# Altium project 8SoundsUSB.PrjPCB (part 2 of 2)

## Sheet XS1_XCORE0.SchDoc: XS1 CORE0
size A3; Date: 2011-11-28; Author: S.Choquette; Revision: 2.0; SheetNumber: 3; SheetTotal: 9
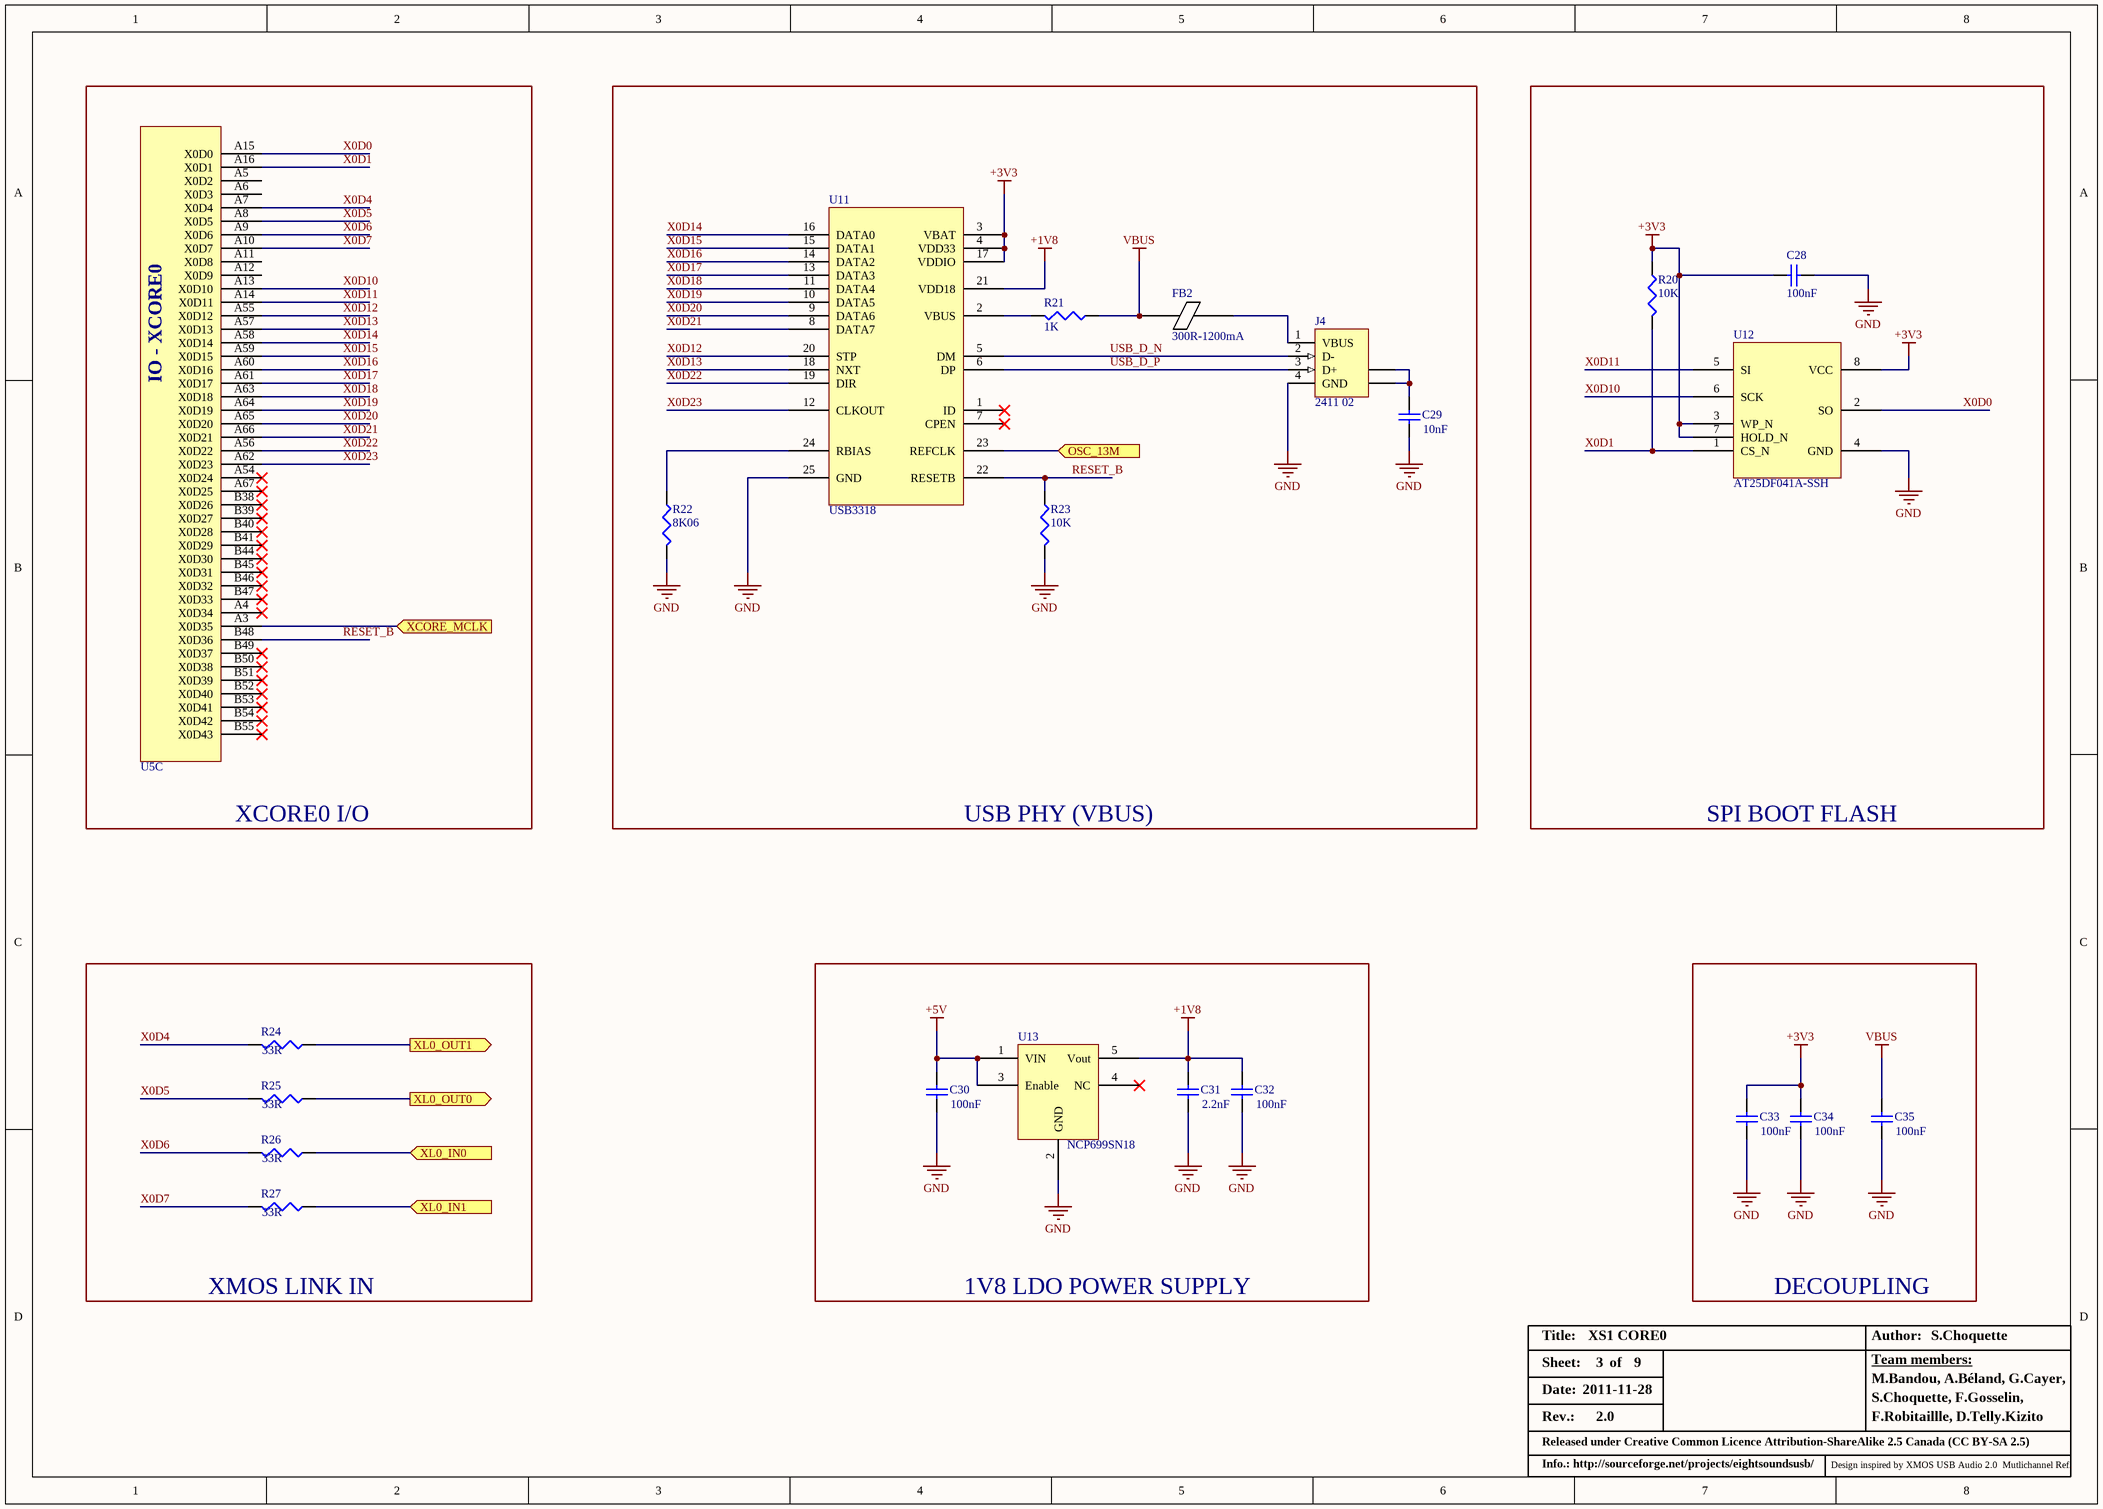
[diagram p7: XS1_XCORE0.SchDoc]

### Parts
C28  value 100nF  [3-0603]
C29  value 10nF  [3-0603]
C30  value 100nF  [3-0603]
C31  value 2.2nF  [3-0603]
C32  value 100nF  [3-0603]
C33  value 100nF  [3-0603]
C34  value 100nF  [3-0603]
C35  value 100nF  [3-0603]
FB2  300R-1200mA  [3-0603]
J4  2411 02  [787924]
R20  value 10K  [3-0603]
R21  value 1K  [3-0603]
R22  value 8K06  [3-0603]
R23  value 10K  [3-0603]
R24  value 33R  [3-0603]
R25  value 33R  [3-0603]
R26  value 33R  [3-0603]
R27  value 33R  [3-0603]
U5  XS1_L2_124QFN  [QFN-124]  (value not drawn)  (part C of 4)
U11  USB3318  [QFN50P400X400-24V9L]
U12  AT25DF041A-SSH  [8S1_L]
U13  NCP699SN18  [SOT23-5AL_MOD(1-07)]

### Blocks framed on the sheet
XCORE0 I/O: U5
USB PHY (VBUS): C29 FB2 J4 R21-R23 U11
SPI BOOT FLASH: C28 R20 U12
XMOS LINK IN: R24-R27
1V8 LDO POWER SUPPLY: C30-C32 U13
DECOUPLING: C33-C35

### Ports
OSC_13M (in), XCORE_MCLK (in), XL0_IN0 (in), XL0_IN1 (in), XL0_OUT0, XL0_OUT1

### Nets
+1V8: C31.2 C32.2 U11.21(VDD18) U13.5(Vout)
+3V3: C28.2 C33.2 C34.2 R20.1 U11.3(VBAT) U11.4(VDD33) U11.17(VDDIO) U12.3(WP_N) U12.7(HOLD_N) U12.8(VCC)
+5V: C30.2 U13.1(VIN) U13.3(Enable)
GND: C28.1 C29.1 C30.1 C31.1 C32.1 C33.1 C34.1 C35.1 J4.4(GND) R22.2 R23.2 U11.25(GND) U12.4(GND) U13.2(GND)
VBUS: C35.2 FB2.2 R21.1
OSC_13M: U11.23(REFCLK) ; port OSC_13M
RESET_B: R23.1 U5.B48(X0D36) U11.22(RESETB)
USB_D_N: J4.2(D-) U11.5(DM)
USB_D_P: J4.3(D+) U11.6(DP)
X0D0: U5.A15(X0D0) U12.2(SO)
X0D1: R20.2 U5.A16(X0D1) U12.1(CS_N)
X0D4: R24.2 U5.A7(X0D4)
X0D5: R25.2 U5.A8(X0D5)
X0D6: R26.2 U5.A9(X0D6)
X0D7: R27.2 U5.A10(X0D7)
X0D10: U5.A13(X0D10) U12.6(SCK)
X0D11: U5.A14(X0D11) U12.5(SI)
X0D12: U5.A55(X0D12) U11.20(STP)
X0D13: U5.A57(X0D13) U11.18(NXT)
X0D14: U5.A58(X0D14) U11.16(DATA0)
X0D15: U5.A59(X0D15) U11.15(DATA1)
X0D16: U5.A60(X0D16) U11.14(DATA2)
X0D17: U5.A61(X0D17) U11.13(DATA3)
X0D18: U5.A63(X0D18) U11.11(DATA4)
X0D19: U5.A64(X0D19) U11.10(DATA5)
X0D20: U5.A65(X0D20) U11.9(DATA6)
X0D21: U5.A66(X0D21) U11.8(DATA7)
X0D22: U5.A56(X0D22) U11.19(DIR)
X0D23: U5.A62(X0D23) U11.12(CLKOUT)
XCORE_MCLK: U5.A3(X0D35) ; port XCORE_MCLK
XL0_IN0: R26.1 ; port XL0_IN0
XL0_IN1: R27.1 ; port XL0_IN1
XL0_OUT0: R25.1 ; port XL0_OUT0
XL0_OUT1: R24.1 ; port XL0_OUT1
NetC29_2: C29.2 J4.5(SHLD) J4.6(SHLD)
NetFB2_1: FB2.1 J4.1(VBUS)
NetR21_2: R21.2 U11.2(VBUS)
NetR22_1: R22.1 U11.24(RBIAS)

Not connected (* = marked no-connect by the designer): U5 A4(X0D34)* A5(X0D2) A6(X0D3) A11(X0D8) A12(X0D9) A54(X0D24)* A67(X0D25)* B38(X0D26)* B39(X0D27)* B40(X0D28)* B41(X0D29)* B44(X0D30)* B45(X0D31)* B46(X0D32)* B47(X0D33)* B49(X0D37)* B50(X0D38)* B51(X0D39)* B52(X0D40)* B53(X0D41)* B54(X0D42)* B55(X0D43)*; U11 1(ID)* 7(CPEN)*; U13 4(NC)*

### Notes on the sheet
- Title:
- Date:
- Sheet:
- of
- Author:
- Team members:
- M.Bandou, A.Béland, G.Cayer,
- Rev.:
- Released under Creative Common Licence Attribution-ShareAlike 2.5 Canada (CC BY-SA 2.5)
- S.Choquette, F.Gosselin,
- F.Robitaillle, D.Telly.Kizito
- Info.: http://sourceforge.net/projects/eightsoundsusb/
- Design inspired by XMOS USB Audio 2.0  Mutlichannel Ref.
- (in symbol XS1_L2_124QFN, part C) IO - XCORE0

### Library data of the parts
C28 C30 C32-C35 = Cap: MLCC 100nF 0603 X7R 16V; Manufacturer: Murata; Part Number: GRM188R71C104KA01; Cost: 0,005
C29 = Cap: MLCC 10nF 0603 X7R 50V; Manufacturer: Murata; Part Number: GRM188R71H103KA01; Cost: 0,005
C31 = Cap: MLCC 2.2uF 0603 X5R 10V; Manufacturer: Murata; Part Number: GRM188R61A225KE34; Cost: 0,005
FB2 = 300R-1200mA: Ferrite 300R -1200mA; Part Number: BLM18SG331TN1D; Manufacturer: Murata
J4 = 787924-1: USB 2.0 connectors  Connecteurs USB 2.0; Manufacturer: Lumberg; TerminationLength: 3.02mm [0.119in.]; Part Number: 2411 02; Cost: *
R20 R23 = Res3: RES 10k 0603 1%; Manufacturer: ROHM; Part Number: MCR03EZPFX1002; Cost: *
R21 = Res3: as R4 on sheet MAIN_POWER; Cost: *
R22 = Res3: RES 8k06 0603 1%; Manufacturer: ROHM; Part Number: MCR03EZPFX8061; Cost: *
R24-R27 = Res3: as R41 on sheet CLOCKING; Cost: *
U5 = XS1_L2_124QFN: Manufacturer: XMOS; Part Number: XS1-L02A-QF124-C4; Cost: *
U11 = USB3318: USB-IF 'High-Speed' compliant to USB 2.0; Manufacturer: SMSC; Part Number: USB3318; Cost: *
U12 = AT25DF041A-SSH: 4-megabit  2.3-volt or  2.7-volt  Minimum  SPI Serial Flash  Memory; Manufacturer: ATMEL; Part Number: AT25DF041A-SSH; Cost: *
U13 = NCP699SN18: 150 mA CMOS Low Iq LDO; Manufacturer: ON Semiconductor; Part Number: NCP699SN18

## Sheet XS1_XCORE1.SchDoc: XS1 XCORE1
size A3; Date: 2011-11-28; Author: S.Choquette; Revision: 2.0; SheetNumber: 4; SheetTotal: 9
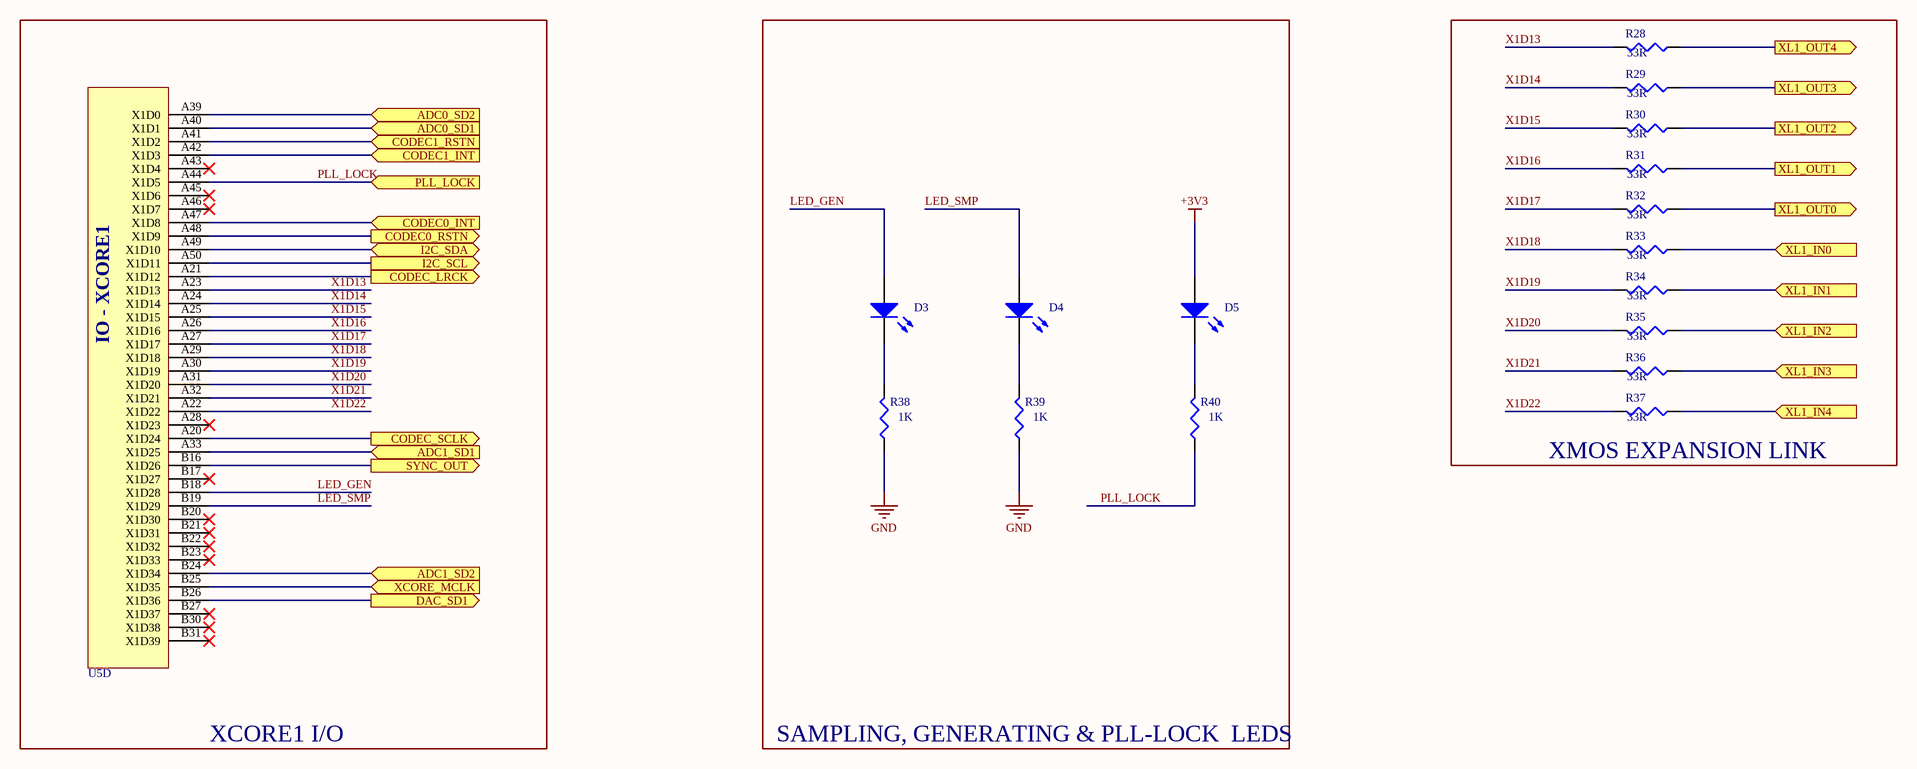
[diagram p8: XS1_XCORE1.SchDoc]

### Parts
D3  GEN  [LED_0603]  (value not drawn)
D4  SMP  [LED_0603]  (value not drawn)
D5  PLL  [LED_0603]  (value not drawn)
R28  value 33R  [3-0603]
R29  value 33R  [3-0603]
R30  value 33R  [3-0603]
R31  value 33R  [3-0603]
R32  value 33R  [3-0603]
R33  value 33R  [3-0603]
R34  value 33R  [3-0603]
R35  value 33R  [3-0603]
R36  value 33R  [3-0603]
R37  value 33R  [3-0603]
R38  value 1K  [3-0603]
R39  value 1K  [3-0603]
R40  value 1K  [3-0603]
U5  XS1_L2_124QFN  [QFN-124]  (value not drawn)  (part D of 4)

### Blocks framed on the sheet
XCORE1 I/O: U5
SAMPLING, GENERATING & PLL-LOCK  LEDS: D3-D5 R38-R40
XMOS EXPANSION LINK: R28-R37

### Ports
ADC0_SD1 (in), ADC0_SD2 (in), ADC1_SD1 (in), ADC1_SD2 (in), CODEC0_INT (in), CODEC0_RSTN (out), CODEC1_INT (in), CODEC1_RSTN (in), CODEC_LRCK (out), CODEC_SCLK (out), DAC_SD1 (out), I2C_SCL (out), I2C_SDA (bidir), PLL_LOCK (in), SYNC_OUT (out), XCORE_MCLK (in), XL1_IN0 (in), XL1_IN1 (in), XL1_IN2 (in), XL1_IN3 (in), XL1_IN4 (in), XL1_OUT0 (out), XL1_OUT1 (out), XL1_OUT2 (out), XL1_OUT3 (out), XL1_OUT4 (out)

### Nets
+3V3: D5.1(A)
GND: R38.1 R39.1
ADC0_SD1: U5.A40(X1D1) ; port ADC0_SD1
ADC0_SD2: U5.A39(X1D0) ; port ADC0_SD2
ADC1_SD1: U5.A33(X1D25) ; port ADC1_SD1
ADC1_SD2: U5.B24(X1D34) ; port ADC1_SD2
CODEC0_INT: U5.A47(X1D8) ; port CODEC0_INT
CODEC0_RSTN: U5.A48(X1D9) ; port CODEC0_RSTN
CODEC1_INT: U5.A42(X1D3) ; port CODEC1_INT
CODEC1_RSTN: U5.A41(X1D2) ; port CODEC1_RSTN
DAC_SD1: U5.B26(X1D36) ; port DAC_SD1
I2C_SCL: U5.A50(X1D11) ; port I2C_SCL
I2C_SDA: U5.A49(X1D10) ; port I2C_SDA
LED_GEN: D3.1(A) U5.B18(X1D28)
LED_SMP: D4.1(A) U5.B19(X1D29)
PLL_LOCK: R40.1 U5.A44(X1D5) ; port PLL_LOCK
SYNC_OUT: U5.B16(X1D26) ; port SYNC_OUT
X1D13: R28.2 U5.A23(X1D13)
X1D14: R29.2 U5.A24(X1D14)
X1D15: R30.2 U5.A25(X1D15)
X1D16: R31.2 U5.A26(X1D16)
X1D17: R32.2 U5.A27(X1D17)
X1D18: R33.2 U5.A29(X1D18)
X1D19: R34.2 U5.A30(X1D19)
X1D20: R35.2 U5.A31(X1D20)
X1D21: R36.2 U5.A32(X1D21)
X1D22: R37.2 U5.A22(X1D22)
XCORE_MCLK: U5.B25(X1D35) ; port XCORE_MCLK
NetD3_2: D3.2(K) R38.2
NetD4_2: D4.2(K) R39.2
NetD5_2: D5.2(K) R40.2
NetJ3_2: R28.1 ; port XL1_OUT4
NetJ3_4: R29.1 ; port XL1_OUT3
NetJ3_6: R31.1 ; port XL1_OUT1
NetJ3_8: R30.1 ; port XL1_OUT2
NetJ3_10: R32.1 ; port XL1_OUT0
NetJ3_12: R35.1 ; port XL1_IN2
NetJ3_14: R33.1 ; port XL1_IN0
NetJ3_16: R36.1 ; port XL1_IN3
NetJ3_18: R34.1 ; port XL1_IN1
NetJ3_20: R37.1 ; port XL1_IN4
NetTP3_1: U5.A21(X1D12) ; port CODEC_LRCK
NetTP7_1: U5.A20(X1D24) ; port CODEC_SCLK

Not connected (* = marked no-connect by the designer): U5 A28(X1D23)* A43(X1D4)* A45(X1D6)* A46(X1D7)* B17(X1D27)* B20(X1D30)* B21(X1D31)* B22(X1D32)* B23(X1D33)* B27(X1D37)* B30(X1D38)* B31(X1D39)*

### Notes on the sheet
- Title:
- Date:
- Sheet:
- of
- Author:
- Team members:
- M.Bandou, A.Béland, G.Cayer,
- Rev.:
- Released under Creative Common Licence Attribution-ShareAlike 2.5 Canada (CC BY-SA 2.5)
- S.Choquette, F.Gosselin,
- F.Robitaillle, D.Telly.Kizito
- Info.: http://sourceforge.net/projects/eightsoundsusb/
- Design inspired by XMOS USB Audio 2.0  Mutlichannel Ref.
- (in symbol XS1_L2_124QFN, part D) IO - XCORE1

### Library data of the parts
D3-D5 = LED2: LED, GREEN, 0603; Manufacturer: Kingbright; Part Number: APT1608CGCK; Publisher: Altium Limited
R28-R37 = Res3: RES 33R 0603 1%; Manufacturer: ROHM; Part Number: MCR03EZPFX33R0; Cost: *
R38-R40 = Res3: RES 1k 0603 1%; Manufacturer: ROHM; Part Number: MCR03EZPFX1001; Cost: *
U5 = XS1_L2_124QFN: Manufacturer: XMOS; Part Number: XS1-L02A-QF124-C4; Cost: *

## Nets that join several sheets
+1V0: MAIN_POWER (TP63.1), XS1_SYSTEM (20 pins)
+1V8: MAIN_POWER (TP62.1), XS1_XCORE0 (C31.2 C32.2 U11.21 U13.5)
+3V3: MAIN_POWER (TP61.1), CLOCKING (11 pins), CODEC0 (13 pins), CODEC1 (14 pins), XS1_SYSTEM (25 pins), XS1_XCORE0 (10 pins), XS1_XCORE1 (D5.1)
+4V3: MAIN_POWER (5 pins), CODEC0 (7 pins), CODEC1 (7 pins), PREAMP0 (16 pins), PREAMP1 (16 pins)
+5V: MAIN_POWER (6 pins), XS1_SYSTEM (8 pins), XS1_XCORE0 (C30.2 U13.1 U13.3)
GND: MAIN_POWER (41 pins), CLOCKING (16 pins), CODEC0 (32 pins), CODEC1 (26 pins), PREAMP0 (32 pins), PREAMP1 (32 pins), XS1_SYSTEM (42 pins), XS1_XCORE0 (14 pins), XS1_XCORE1 (R38.1 R39.1)
VBUS: MAIN_POWER (C9.2 D1.1 TP64.1 U3.6), XS1_XCORE0 (C35.2 FB2.2 R21.1)
ADC0_AIN1_N: MAIN_POWER (TP1.1), CODEC0 (U19.45), PREAMP0 (C93.2 R68.1 R78.1)
ADC0_AIN1_P: MAIN_POWER (TP5.1), CODEC0 (U19.46), PREAMP0 (C93.1 R70.1 R80.1)
ADC0_AIN2_N: MAIN_POWER (TP11.1), CODEC0 (U19.47), PREAMP0 (C105.2 R84.1 R94.1)
ADC0_AIN2_P: MAIN_POWER (TP9.1), CODEC0 (U19.48), PREAMP0 (C105.1 R86.1 R96.1)
ADC0_AIN3_N: MAIN_POWER (TP16.1), CODEC0 (U19.49), PREAMP0 (C94.2 R69.1 R79.1)
ADC0_AIN3_P: MAIN_POWER (TP14.1), CODEC0 (U19.50), PREAMP0 (C94.1 R71.1 R81.1)
ADC0_AIN4_N: MAIN_POWER (TP21.1), CODEC0 (U19.51), PREAMP0 (C106.2 R85.1 R95.1)
ADC0_AIN4_P: MAIN_POWER (TP19.1), CODEC0 (U19.52), PREAMP0 (C106.1 R87.1 R97.1)
ADC0_SD1: MAIN_POWER (TP4.1), CODEC0 (U19.13), XS1_XCORE1 (U5.A40)
ADC0_SD2: MAIN_POWER (TP8.1), CODEC0 (U19.12), XS1_XCORE1 (U5.A39)
ADC1_AIN1_N: MAIN_POWER (TP31.1), CODEC1 (U20.45), PREAMP1 (C117.2 R100.1 R110.1)
ADC1_AIN1_P: MAIN_POWER (TP33.1), CODEC1 (U20.46), PREAMP1 (C117.1 R102.1 R112.1)
ADC1_AIN2_N: MAIN_POWER (TP36.1), CODEC1 (U20.47), PREAMP1 (C129.2 R116.1 R126.1)
ADC1_AIN2_P: MAIN_POWER (TP35.1), CODEC1 (U20.48), PREAMP1 (C129.1 R118.1 R128.1)
ADC1_AIN3_N: MAIN_POWER (TP38.1), CODEC1 (U20.49), PREAMP1 (C118.2 R101.1 R111.1)
ADC1_AIN3_P: MAIN_POWER (TP37.1), CODEC1 (U20.50), PREAMP1 (C118.1 R103.1 R113.1)
ADC1_AIN4_N: MAIN_POWER (TP40.1), CODEC1 (U20.51), PREAMP1 (C130.2 R117.1 R127.1)
ADC1_AIN4_P: MAIN_POWER (TP39.1), CODEC1 (U20.52), PREAMP1 (C130.1 R119.1 R129.1)
ADC1_SD1: MAIN_POWER (TP10.1), CODEC1 (U20.13), XS1_XCORE1 (U5.A33)
ADC1_SD2: MAIN_POWER (TP13.1), CODEC1 (U20.12), XS1_XCORE1 (U5.B24)
CODEC0_INT: MAIN_POWER (TP12.1), CODEC0 (U19.61), XS1_XCORE1 (U5.A47)
CODEC0_RSTN: MAIN_POWER (TP15.1), CODEC0 (R61.2 U19.3), XS1_XCORE1 (U5.A48)
CODEC0_VQ: MAIN_POWER (TP24.1), CODEC0 (C61.1 C62.2 U19.43), PREAMP0 (12 pins)
CODEC1_INT: MAIN_POWER (TP17.1), CODEC1 (U20.61), XS1_XCORE1 (U5.A42)
CODEC1_RSTN: MAIN_POWER (TP20.1), CODEC1 (R67.2 U20.3), XS1_XCORE1 (U5.A41)
CODEC1_VQ: MAIN_POWER (TP42.1), CODEC1 (C79.1 C80.2 U20.43), PREAMP1 (12 pins)
DAC_SD1: MAIN_POWER (TP18.1), CODEC0 (U19.17), XS1_XCORE1 (U5.B26)
I2C_SCL: MAIN_POWER (TP29.1), CLOCKING (U15.9), CODEC0 (R57.1 U19.63), CODEC1 (R64.1 U20.63), XS1_XCORE1 (U5.A50)
I2C_SDA: MAIN_POWER (TP30.1), CLOCKING (U15.10), CODEC0 (R58.1 U19.64), CODEC1 (R65.1 U20.64), XS1_XCORE1 (U5.A49)
NetJ3_2: XS1_SYSTEM (J3.2), XS1_XCORE1 (R28.1)
NetJ3_4: XS1_SYSTEM (J3.4), XS1_XCORE1 (R29.1)
NetJ3_6: XS1_SYSTEM (J3.6), XS1_XCORE1 (R31.1)
NetJ3_8: XS1_SYSTEM (J3.8), XS1_XCORE1 (R30.1)
NetJ3_10: XS1_SYSTEM (J3.10), XS1_XCORE1 (R32.1)
NetJ3_12: XS1_SYSTEM (J3.12), XS1_XCORE1 (R35.1)
NetJ3_14: XS1_SYSTEM (J3.14), XS1_XCORE1 (R33.1)
NetJ3_16: XS1_SYSTEM (J3.16), XS1_XCORE1 (R36.1)
NetJ3_18: XS1_SYSTEM (J3.18), XS1_XCORE1 (R34.1)
NetJ3_20: XS1_SYSTEM (J3.20), XS1_XCORE1 (R37.1)
NetR42_1: MAIN_POWER (TP22.1), CLOCKING (R42.1), CODEC0 (U19.10)
NetR43_1: MAIN_POWER (TP41.1), CLOCKING (R43.1), CODEC1 (U20.10)
NetR46_1: MAIN_POWER (TP6.1), CLOCKING (R46.1), CODEC0 (U19.9)
NetR47_1: MAIN_POWER (TP34.1), CLOCKING (R47.1), CODEC1 (U20.9)
NetR48_1: MAIN_POWER (TP27.1), CLOCKING (R48.1), CODEC0 (U19.18)
NetR49_1: MAIN_POWER (TP2.1), CLOCKING (R49.1), CODEC0 (U19.5)
NetR50_1: MAIN_POWER (TP32.1), CLOCKING (R50.1), CODEC1 (U20.5)
NetR51_1: MAIN_POWER (TP25.1), CLOCKING (R51.1), CODEC0 (U19.19)
NetTP3_1: MAIN_POWER (TP3.1), CLOCKING (U18.1 U18.3 U18.6), XS1_XCORE1 (U5.A21)
NetTP7_1: MAIN_POWER (TP7.1), CLOCKING (U17.1 U17.3 U17.6), XS1_XCORE1 (U5.A20)
OSC_13M: MAIN_POWER (TP43.1), CLOCKING (R44.1 R45.1 U14.4), XS1_SYSTEM (U5.B6 U5.B7), XS1_XCORE0 (U11.23)
PLL_LOCK: MAIN_POWER (TP26.1), CLOCKING (U15.4), XS1_XCORE1 (R40.1 U5.A44)
SYNC_OUT: MAIN_POWER (TP28.1), CLOCKING (U15.5), XS1_XCORE1 (U5.B16)
XCORE_MCLK: MAIN_POWER (TP23.1), CLOCKING (R41.1), XS1_XCORE0 (U5.A3), XS1_XCORE1 (U5.B25)
XL0_IN0: XS1_SYSTEM (J2.14), XS1_XCORE0 (R26.1)
XL0_IN1: XS1_SYSTEM (J2.18), XS1_XCORE0 (R27.1)
XL0_OUT0: XS1_SYSTEM (J2.10), XS1_XCORE0 (R25.1)
XL0_OUT1: XS1_SYSTEM (J2.6), XS1_XCORE0 (R24.1)